# Altium project SnippetsMemory.PrjPCB
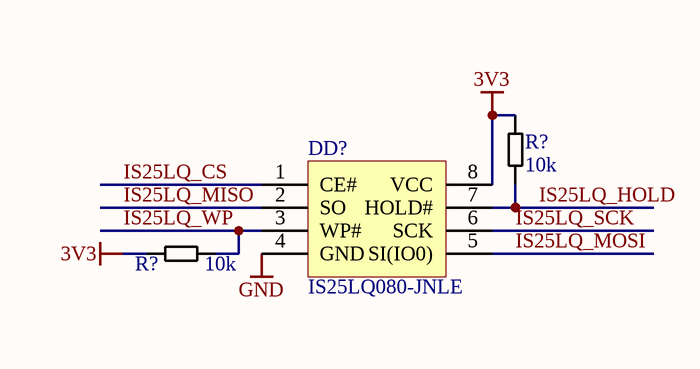
[diagram p0: IS25LQ080_SPI.SchDoc]
1 sheet, 3 parts. Net scope: global (net labels, ports and power ports of the same name join across sheets).

## Sheet IS25LQ080_SPI.SchDoc
size A4

### Parts
(Parts that share a designator on the sheet are numbered #1, #2 ... from top to bottom, then left to right.)
DD?  IS25LQ080-JNLE  [SO-8]
R?#1  10k  [R0603]
R?#2  10k  [R0603]

### Nets
3V3: DD?.8(VCC) R?#1.2 R?#2.1
GND: DD?.4(GND)
IS25LQ_CS: DD?.1(CE#)
IS25LQ_HOLD: DD?.7(HOLD#) R?#1.1
IS25LQ_MISO: DD?.2(SO)
IS25LQ_MOSI: DD?.5(SI(IO0))
IS25LQ_SCK: DD?.6(SCK)
IS25LQ_WP: DD?.3(WP#) R?#2.2

### Library data of the parts
DD? = IS25LQ080: ISSI SPI FLASH memory 8 Mbit; SO-8: ...-JN; SO-8W: ...-JB
R?#1 R?#2 = R: Resistor